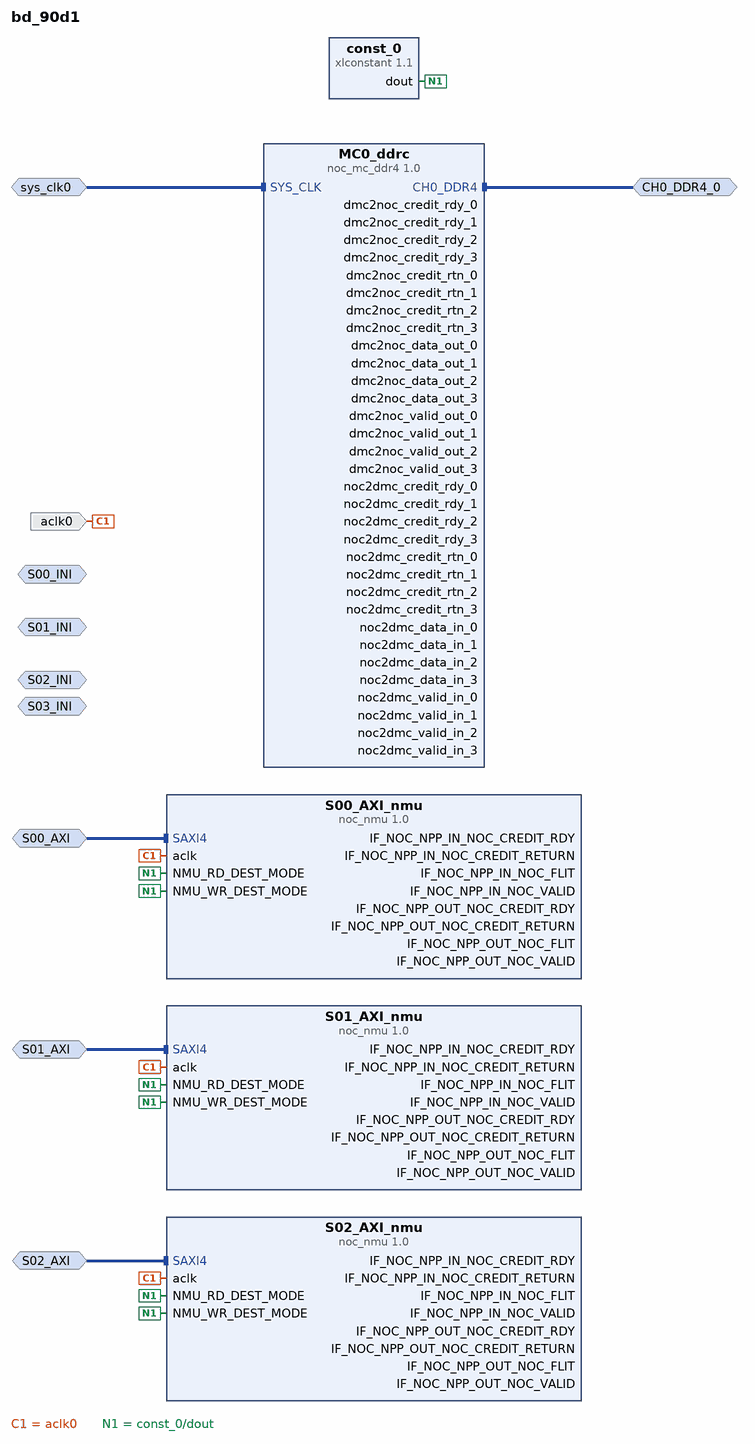
[diagram p0: block diagram of the top level]
# Vivado block design bd_90d1, xcvc1902-vsva2197-2MP-e-S, Vivado 2024.1
create_bd_design bd_90d1

create_bd_intf_port -mode Slave -vlnv xilinx.com:interface:aximm_rtl:1.0 S00_AXI
set_property -dict [list \
  CONFIG.CATEGORY pl \
  CONFIG.CONNECTIONS {MC_1 {read_bw {1192} write_bw {1192} read_avg_burst {8} write_avg_burst {8}}} \
] [get_bd_intf_ports S00_AXI]
create_bd_intf_port -mode Slave -vlnv xilinx.com:interface:aximm_rtl:1.0 S01_AXI
set_property -dict [list \
  CONFIG.CATEGORY pl \
  CONFIG.CONNECTIONS {MC_2 {read_bw {1192} write_bw {1192} read_avg_burst {8} write_avg_burst {8}}} \
] [get_bd_intf_ports S01_AXI]
create_bd_intf_port -mode Slave -vlnv xilinx.com:interface:aximm_rtl:1.0 S02_AXI
set_property -dict [list \
  CONFIG.CATEGORY pl \
  CONFIG.CONNECTIONS {MC_3 {read_bw {1192} write_bw {1192} read_avg_burst {8} write_avg_burst {8}}} \
] [get_bd_intf_ports S02_AXI]
create_bd_intf_port -mode Slave -vlnv xilinx.com:interface:inimm_rtl:1.0 S00_INI
set_property -dict [list \
  CONFIG.CONNECTIONS {MC_0 { read_bw {5} write_bw {5} read_avg_burst {4} write_avg_burst {4}} } \
  CONFIG.INI_STRATEGY auto \
] [get_bd_intf_ports S00_INI]
create_bd_intf_port -mode Slave -vlnv xilinx.com:interface:inimm_rtl:1.0 S01_INI
set_property -dict [list \
  CONFIG.CONNECTIONS {MC_1 { read_bw {5} write_bw {5} read_avg_burst {4} write_avg_burst {4}} } \
  CONFIG.INI_STRATEGY auto \
] [get_bd_intf_ports S01_INI]
create_bd_intf_port -mode Slave -vlnv xilinx.com:interface:inimm_rtl:1.0 S02_INI
set_property -dict [list \
  CONFIG.CONNECTIONS {MC_2 { read_bw {5} write_bw {5} read_avg_burst {4} write_avg_burst {4}} } \
  CONFIG.INI_STRATEGY auto \
] [get_bd_intf_ports S02_INI]
create_bd_intf_port -mode Slave -vlnv xilinx.com:interface:inimm_rtl:1.0 S03_INI
set_property -dict [list \
  CONFIG.CONNECTIONS {MC_3 { read_bw {5} write_bw {5} read_avg_burst {4} write_avg_burst {4}} } \
  CONFIG.INI_STRATEGY auto \
] [get_bd_intf_ports S03_INI]
create_bd_intf_port -mode Slave -vlnv xilinx.com:interface:diff_clock_rtl:1.0 sys_clk0
create_bd_intf_port -mode Master -vlnv xilinx.com:interface:ddr4_rtl:1.0 CH0_DDR4_0
create_bd_port -dir I -type clk aclk0
set_property -dict {CONFIG.ASSOCIATED_BUSIF S00_AXI:S01_AXI:S02_AXI} [get_bd_ports aclk0]

create_bd_cell -type ip -vlnv xilinx.com:ip:noc_nmu:1.0 S02_AXI_nmu
set_property -dict [list \
  CONFIG.ATTR_FILE nocattrs.dat \
  CONFIG.NOC_FREQ 1000 \
  CONFIG.USER_NOC_CATEGORY PL \
  CONFIG.USER_NOC_DATA512_WIDTH 32 \
  CONFIG.USER_NOC_NMU_WIDTH 512 \
  CONFIG.USER_PHYS_NAME NOC_NMU512_X0Y1 \
  CONFIG.USER_REG_ADDR_DST0 0x00000 \
  CONFIG.USER_REG_ADDR_DST1 0x00000 \
  CONFIG.USER_REG_ADDR_DST2 0x00000 \
  CONFIG.USER_REG_ADDR_DST3 0x00000 \
  CONFIG.USER_REG_ADDR_DST4 0x00000 \
  CONFIG.USER_REG_ADDR_DST5 0x00000 \
  CONFIG.USER_REG_ADDR_DST6 0x00000 \
  CONFIG.USER_REG_ADDR_DST7 0x00000 \
  CONFIG.USER_REG_ADDR_DST8 0x00000 \
  CONFIG.USER_REG_ADDR_DST9 0x00000 \
  CONFIG.USER_REG_ADDR_DST10 0x00000 \
  CONFIG.USER_REG_ADDR_DST11 0x00000 \
  CONFIG.USER_REG_ADDR_DST12 0x00000 \
  CONFIG.USER_REG_ADDR_DST13 0x00000 \
  CONFIG.USER_REG_ADDR_DST14 0x00000 \
  CONFIG.USER_REG_ADDR_DST15 0x00000 \
  CONFIG.USER_REG_ADDR_ENABLE 0x0000 \
  CONFIG.USER_REG_ADDR_MADDR0 0x00000000 \
  CONFIG.USER_REG_ADDR_MADDR1 0x00000000 \
  CONFIG.USER_REG_ADDR_MADDR2 0x00000000 \
  CONFIG.USER_REG_ADDR_MADDR3 0x00000000 \
  CONFIG.USER_REG_ADDR_MADDR4 0x00000000 \
  CONFIG.USER_REG_ADDR_MADDR5 0x00000000 \
  CONFIG.USER_REG_ADDR_MADDR6 0x00000000 \
  CONFIG.USER_REG_ADDR_MADDR7 0x00000000 \
  CONFIG.USER_REG_ADDR_MADDR8 0x00000000 \
  CONFIG.USER_REG_ADDR_MADDR9 0x00000000 \
  CONFIG.USER_REG_ADDR_MADDR10 0x00000000 \
  CONFIG.USER_REG_ADDR_MADDR11 0x00000000 \
  CONFIG.USER_REG_ADDR_MADDR12 0x00000000 \
  CONFIG.USER_REG_ADDR_MADDR13 0x00000000 \
  CONFIG.USER_REG_ADDR_MADDR14 0x00000000 \
  CONFIG.USER_REG_ADDR_MADDR15 0x00000000 \
  CONFIG.USER_REG_ADDR_MASK0 0x00000000 \
  CONFIG.USER_REG_ADDR_MASK1 0x00000000 \
  CONFIG.USER_REG_ADDR_MASK2 0x00000000 \
  CONFIG.USER_REG_ADDR_MASK3 0x00000000 \
  CONFIG.USER_REG_ADDR_MASK4 0x00000000 \
  CONFIG.USER_REG_ADDR_MASK5 0x00000000 \
  CONFIG.USER_REG_ADDR_MASK6 0x00000000 \
  CONFIG.USER_REG_ADDR_MASK7 0x00000000 \
  CONFIG.USER_REG_ADDR_MASK8 0x00000000 \
  CONFIG.USER_REG_ADDR_MASK9 0x00000000 \
  CONFIG.USER_REG_ADDR_MASK10 0x00000000 \
  CONFIG.USER_REG_ADDR_MASK11 0x00000000 \
  CONFIG.USER_REG_ADDR_MASK12 0x00000000 \
  CONFIG.USER_REG_ADDR_MASK13 0x00000000 \
  CONFIG.USER_REG_ADDR_MASK14 0x00000000 \
  CONFIG.USER_REG_ADDR_MASK15 0x00000000 \
  CONFIG.USER_REG_ADDR_REMAP 0x0000 \
  CONFIG.USER_REG_ADDR_RPADDR0 0x00000000 \
  CONFIG.USER_REG_ADDR_RPADDR1 0x00000000 \
  CONFIG.USER_REG_ADDR_RPADDR2 0x00000000 \
  CONFIG.USER_REG_ADDR_RPADDR3 0x00000000 \
  CONFIG.USER_REG_ADDR_RPADDR4 0x00000000 \
  CONFIG.USER_REG_ADDR_RPADDR5 0x00000000 \
  CONFIG.USER_REG_ADDR_RPADDR6 0x00000000 \
  CONFIG.USER_REG_ADDR_RPADDR7 0x00000000 \
  CONFIG.USER_REG_ADDR_RPADDR8 0x00000000 \
  CONFIG.USER_REG_ADDR_RPADDR9 0x00000000 \
  CONFIG.USER_REG_ADDR_RPADDR10 0x00000000 \
  CONFIG.USER_REG_ADDR_RPADDR11 0x00000000 \
  CONFIG.USER_REG_ADDR_RPADDR12 0x00000000 \
  CONFIG.USER_REG_ADDR_RPADDR13 0x00000000 \
  CONFIG.USER_REG_ADDR_RPADDR14 0x00000000 \
  CONFIG.USER_REG_ADDR_RPADDR15 0x00000000 \
  CONFIG.USER_REG_ADR_MAP_CPM 0x0FC0 \
  CONFIG.USER_REG_ADR_MAP_FPD_AFI_0 0x0FC0 \
  CONFIG.USER_REG_ADR_MAP_FPD_AFI_1 0x0FC0 \
  CONFIG.USER_REG_ADR_MAP_LPD_AFI_FS 0x0FC0 \
  CONFIG.USER_REG_ADR_MAP_ME_ARRAY_0 0x0FC0 \
  CONFIG.USER_REG_ADR_MAP_ME_ARRAY_1 0x0FC0 \
  CONFIG.USER_REG_ADR_MAP_ME_ARRAY_2 0x0FC0 \
  CONFIG.USER_REG_ADR_MAP_ME_ARRAY_3 0x0FC0 \
  CONFIG.USER_REG_ADR_MAP_PCIE 0x0FC0 \
  CONFIG.USER_REG_ADR_MAP_PMC 0x0FC0 \
  CONFIG.USER_REG_ADR_MAP_PMC_ALIAS_0 0x0FC0 \
  CONFIG.USER_REG_ADR_MAP_PMC_ALIAS_1 0x0FC0 \
  CONFIG.USER_REG_ADR_MAP_PMC_ALIAS_2 0x0FC0 \
  CONFIG.USER_REG_ADR_MAP_PMC_ALIAS_3 0x0FC0 \
  CONFIG.USER_REG_ADR_MAP_QSPI 0x0FC0 \
  CONFIG.USER_REG_ADR_MAP_STM_GIC 0x0FC0 \
  CONFIG.USER_REG_ADR_MAP_XPDS 0x0FC0 \
  CONFIG.USER_REG_AXI_LOOPBACK 0x00 \
  CONFIG.USER_REG_AXI_NON_MOD_DISABLE 0x0 \
  CONFIG.USER_REG_AXI_PAR_CHK 0x0 \
  CONFIG.USER_REG_CHOPSIZE 0xA \
  CONFIG.USER_REG_DDR_ADR_MAP0 0x06000 \
  CONFIG.USER_REG_DDR_ADR_MAP1 0x01FFF \
  CONFIG.USER_REG_DDR_ADR_MAP2 0x01FFF \
  CONFIG.USER_REG_DDR_ADR_MAP3 0x01FFF \
  CONFIG.USER_REG_DDR_ADR_MAP4 0x01FFF \
  CONFIG.USER_REG_DDR_ADR_MAP5 0x01FFF \
  CONFIG.USER_REG_DDR_ADR_MAP6 0x01FFF \
  CONFIG.USER_REG_DDR_DST_MAP0 0x4C0 \
  CONFIG.USER_REG_DDR_DST_MAP1 0xFC0 \
  CONFIG.USER_REG_DDR_DST_MAP2 0xFC0 \
  CONFIG.USER_REG_DDR_DST_MAP3 0xFC0 \
  CONFIG.USER_REG_DDR_DST_MAP4 0xFC0 \
  CONFIG.USER_REG_DDR_DST_MAP5 0xFC0 \
  CONFIG.USER_REG_DDR_DST_MAP6 0xFC0 \
  CONFIG.USER_REG_DDR_DST_MAP7 0xFC0 \
  CONFIG.USER_REG_DWIDTH 0x2 \
  CONFIG.USER_REG_ECC_CHK_EN 0x1 \
  CONFIG.USER_REG_HBM_MAP_T0_CH0 0x0FC0 \
  CONFIG.USER_REG_HBM_MAP_T0_CH1 0x0FC0 \
  CONFIG.USER_REG_HBM_MAP_T0_CH2 0x0FC0 \
  CONFIG.USER_REG_HBM_MAP_T0_CH3 0x0FC0 \
  CONFIG.USER_REG_HBM_MAP_T0_CH4 0x0FC0 \
  CONFIG.USER_REG_HBM_MAP_T0_CH5 0x0FC0 \
  CONFIG.USER_REG_HBM_MAP_T0_CH6 0x0FC0 \
  CONFIG.USER_REG_HBM_MAP_T0_CH7 0x0FC0 \
  CONFIG.USER_REG_HBM_MAP_T0_CH8 0x0FC0 \
  CONFIG.USER_REG_HBM_MAP_T0_CH9 0x0FC0 \
  CONFIG.USER_REG_HBM_MAP_T0_CH10 0x0FC0 \
  CONFIG.USER_REG_HBM_MAP_T0_CH11 0x0FC0 \
  CONFIG.USER_REG_HBM_MAP_T0_CH12 0x0FC0 \
  CONFIG.USER_REG_HBM_MAP_T0_CH13 0x0FC0 \
  CONFIG.USER_REG_HBM_MAP_T0_CH14 0x0FC0 \
  CONFIG.USER_REG_HBM_MAP_T0_CH15 0x0FC0 \
  CONFIG.USER_REG_HBM_MAP_T1_CH0 0x0FC0 \
  CONFIG.USER_REG_HBM_MAP_T1_CH1 0x0FC0 \
  CONFIG.USER_REG_HBM_MAP_T1_CH2 0x0FC0 \
  CONFIG.USER_REG_HBM_MAP_T1_CH3 0x0FC0 \
  CONFIG.USER_REG_HBM_MAP_T1_CH4 0x0FC0 \
  CONFIG.USER_REG_HBM_MAP_T1_CH5 0x0FC0 \
  CONFIG.USER_REG_HBM_MAP_T1_CH6 0x0FC0 \
  CONFIG.USER_REG_HBM_MAP_T1_CH7 0x0FC0 \
  CONFIG.USER_REG_HBM_MAP_T1_CH8 0x0FC0 \
  CONFIG.USER_REG_HBM_MAP_T1_CH9 0x0FC0 \
  CONFIG.USER_REG_HBM_MAP_T1_CH10 0x0FC0 \
  CONFIG.USER_REG_HBM_MAP_T1_CH11 0x0FC0 \
  CONFIG.USER_REG_HBM_MAP_T1_CH12 0x0FC0 \
  CONFIG.USER_REG_HBM_MAP_T1_CH13 0x0FC0 \
  CONFIG.USER_REG_HBM_MAP_T1_CH14 0x0FC0 \
  CONFIG.USER_REG_HBM_MAP_T1_CH15 0x0FC0 \
  CONFIG.USER_REG_HBM_MAP_T2_CH0 0x0FC0 \
  CONFIG.USER_REG_HBM_MAP_T2_CH1 0x0FC0 \
  CONFIG.USER_REG_HBM_MAP_T2_CH2 0x0FC0 \
  CONFIG.USER_REG_HBM_MAP_T2_CH3 0x0FC0 \
  CONFIG.USER_REG_HBM_MAP_T2_CH4 0x0FC0 \
  CONFIG.USER_REG_HBM_MAP_T2_CH5 0x0FC0 \
  CONFIG.USER_REG_HBM_MAP_T2_CH6 0x0FC0 \
  CONFIG.USER_REG_HBM_MAP_T2_CH7 0x0FC0 \
  CONFIG.USER_REG_HBM_MAP_T2_CH8 0x0FC0 \
  CONFIG.USER_REG_HBM_MAP_T2_CH9 0x0FC0 \
  CONFIG.USER_REG_HBM_MAP_T2_CH10 0x0FC0 \
  CONFIG.USER_REG_HBM_MAP_T2_CH11 0x0FC0 \
  CONFIG.USER_REG_HBM_MAP_T2_CH12 0x0FC0 \
  CONFIG.USER_REG_HBM_MAP_T2_CH13 0x0FC0 \
  CONFIG.USER_REG_HBM_MAP_T2_CH14 0x0FC0 \
  CONFIG.USER_REG_HBM_MAP_T2_CH15 0x0FC0 \
  CONFIG.USER_REG_HBM_MAP_T3_CH0 0x0FC0 \
  CONFIG.USER_REG_HBM_MAP_T3_CH1 0x0FC0 \
  CONFIG.USER_REG_HBM_MAP_T3_CH2 0x0FC0 \
  CONFIG.USER_REG_HBM_MAP_T3_CH3 0x0FC0 \
  CONFIG.USER_REG_HBM_MAP_T3_CH4 0x0FC0 \
  CONFIG.USER_REG_HBM_MAP_T3_CH5 0x0FC0 \
  CONFIG.USER_REG_HBM_MAP_T3_CH6 0x0FC0 \
  CONFIG.USER_REG_HBM_MAP_T3_CH7 0x0FC0 \
  CONFIG.USER_REG_HBM_MAP_T3_CH8 0x0FC0 \
  CONFIG.USER_REG_HBM_MAP_T3_CH9 0x0FC0 \
  CONFIG.USER_REG_HBM_MAP_T3_CH10 0x0FC0 \
  CONFIG.USER_REG_HBM_MAP_T3_CH11 0x0FC0 \
  CONFIG.USER_REG_HBM_MAP_T3_CH12 0x0FC0 \
  CONFIG.USER_REG_HBM_MAP_T3_CH13 0x0FC0 \
  CONFIG.USER_REG_HBM_MAP_T3_CH14 0x0FC0 \
  CONFIG.USER_REG_HBM_MAP_T3_CH15 0x0FC0 \
  CONFIG.USER_REG_MODE_SELECT 0x0000 \
  CONFIG.USER_REG_OUTSTANDING_RD_TXN 0x40 \
  CONFIG.USER_REG_OUTSTANDING_WR_TXN 0x40 \
  CONFIG.USER_REG_PRIORITY 0x0 \
  CONFIG.USER_REG_RD_AXPROT_SEL 0x00 \
  CONFIG.USER_REG_RD_RATE_CREDIT_DROP 0x004 \
  CONFIG.USER_REG_RD_RATE_CREDIT_LIMIT 0x0100 \
  CONFIG.USER_REG_RD_VCA_TOKEN0 0x55 \
  CONFIG.USER_REG_RPOISON_TO_SLVERR 0x0 \
  CONFIG.USER_REG_RROB_RAM_SETTING 0x012 \
  CONFIG.USER_REG_SMID_SEL 0x00000 \
  CONFIG.USER_REG_SRC 0x000 \
  CONFIG.USER_REG_TBASE_AXI_TIMEOUT 0x1 \
  CONFIG.USER_REG_TBASE_MODE_RLIMIT_RD 0x2 \
  CONFIG.USER_REG_TBASE_MODE_RLIMIT_WR 0x2 \
  CONFIG.USER_REG_TBASE_TRK_TIMEOUT 0x1 \
  CONFIG.USER_REG_VC_MAP 0xFAC \
  CONFIG.USER_REG_WBUF_LAUNCH_SIZE 0x10 \
  CONFIG.USER_REG_WBUF_RAM_SETTING 0x012 \
  CONFIG.USER_REG_WR_AXPROT_SEL 0x00 \
  CONFIG.USER_REG_WR_RATE_CREDIT_DROP 0x004 \
  CONFIG.USER_REG_WR_RATE_CREDIT_LIMIT 0x0100 \
  CONFIG.USER_REG_WR_VCA_TOKEN0 0xFF \
] [get_bd_cells S02_AXI_nmu]
create_bd_cell -type ip -vlnv xilinx.com:ip:xlconstant:1.1 const_0
set_property -dict {CONFIG.CONST_VAL 0 CONFIG.CONST_WIDTH 1} [get_bd_cells const_0]
create_bd_cell -type ip -vlnv xilinx.com:ip:noc_nmu:1.0 S01_AXI_nmu
set_property -dict [list \
  CONFIG.ATTR_FILE nocattrs.dat \
  CONFIG.NOC_FREQ 1000 \
  CONFIG.USER_NOC_CATEGORY PL \
  CONFIG.USER_NOC_DATA512_WIDTH 32 \
  CONFIG.USER_NOC_NMU_WIDTH 512 \
  CONFIG.USER_PHYS_NAME NOC_NMU512_X1Y0 \
  CONFIG.USER_REG_ADDR_DST0 0x00000 \
  CONFIG.USER_REG_ADDR_DST1 0x00000 \
  CONFIG.USER_REG_ADDR_DST2 0x00000 \
  CONFIG.USER_REG_ADDR_DST3 0x00000 \
  CONFIG.USER_REG_ADDR_DST4 0x00000 \
  CONFIG.USER_REG_ADDR_DST5 0x00000 \
  CONFIG.USER_REG_ADDR_DST6 0x00000 \
  CONFIG.USER_REG_ADDR_DST7 0x00000 \
  CONFIG.USER_REG_ADDR_DST8 0x00000 \
  CONFIG.USER_REG_ADDR_DST9 0x00000 \
  CONFIG.USER_REG_ADDR_DST10 0x00000 \
  CONFIG.USER_REG_ADDR_DST11 0x00000 \
  CONFIG.USER_REG_ADDR_DST12 0x00000 \
  CONFIG.USER_REG_ADDR_DST13 0x00000 \
  CONFIG.USER_REG_ADDR_DST14 0x00000 \
  CONFIG.USER_REG_ADDR_DST15 0x00000 \
  CONFIG.USER_REG_ADDR_ENABLE 0x0000 \
  CONFIG.USER_REG_ADDR_MADDR0 0x00000000 \
  CONFIG.USER_REG_ADDR_MADDR1 0x00000000 \
  CONFIG.USER_REG_ADDR_MADDR2 0x00000000 \
  CONFIG.USER_REG_ADDR_MADDR3 0x00000000 \
  CONFIG.USER_REG_ADDR_MADDR4 0x00000000 \
  CONFIG.USER_REG_ADDR_MADDR5 0x00000000 \
  CONFIG.USER_REG_ADDR_MADDR6 0x00000000 \
  CONFIG.USER_REG_ADDR_MADDR7 0x00000000 \
  CONFIG.USER_REG_ADDR_MADDR8 0x00000000 \
  CONFIG.USER_REG_ADDR_MADDR9 0x00000000 \
  CONFIG.USER_REG_ADDR_MADDR10 0x00000000 \
  CONFIG.USER_REG_ADDR_MADDR11 0x00000000 \
  CONFIG.USER_REG_ADDR_MADDR12 0x00000000 \
  CONFIG.USER_REG_ADDR_MADDR13 0x00000000 \
  CONFIG.USER_REG_ADDR_MADDR14 0x00000000 \
  CONFIG.USER_REG_ADDR_MADDR15 0x00000000 \
  CONFIG.USER_REG_ADDR_MASK0 0x00000000 \
  CONFIG.USER_REG_ADDR_MASK1 0x00000000 \
  CONFIG.USER_REG_ADDR_MASK2 0x00000000 \
  CONFIG.USER_REG_ADDR_MASK3 0x00000000 \
  CONFIG.USER_REG_ADDR_MASK4 0x00000000 \
  CONFIG.USER_REG_ADDR_MASK5 0x00000000 \
  CONFIG.USER_REG_ADDR_MASK6 0x00000000 \
  CONFIG.USER_REG_ADDR_MASK7 0x00000000 \
  CONFIG.USER_REG_ADDR_MASK8 0x00000000 \
  CONFIG.USER_REG_ADDR_MASK9 0x00000000 \
  CONFIG.USER_REG_ADDR_MASK10 0x00000000 \
  CONFIG.USER_REG_ADDR_MASK11 0x00000000 \
  CONFIG.USER_REG_ADDR_MASK12 0x00000000 \
  CONFIG.USER_REG_ADDR_MASK13 0x00000000 \
  CONFIG.USER_REG_ADDR_MASK14 0x00000000 \
  CONFIG.USER_REG_ADDR_MASK15 0x00000000 \
  CONFIG.USER_REG_ADDR_REMAP 0x0000 \
  CONFIG.USER_REG_ADDR_RPADDR0 0x00000000 \
  CONFIG.USER_REG_ADDR_RPADDR1 0x00000000 \
  CONFIG.USER_REG_ADDR_RPADDR2 0x00000000 \
  CONFIG.USER_REG_ADDR_RPADDR3 0x00000000 \
  CONFIG.USER_REG_ADDR_RPADDR4 0x00000000 \
  CONFIG.USER_REG_ADDR_RPADDR5 0x00000000 \
  CONFIG.USER_REG_ADDR_RPADDR6 0x00000000 \
  CONFIG.USER_REG_ADDR_RPADDR7 0x00000000 \
  CONFIG.USER_REG_ADDR_RPADDR8 0x00000000 \
  CONFIG.USER_REG_ADDR_RPADDR9 0x00000000 \
  CONFIG.USER_REG_ADDR_RPADDR10 0x00000000 \
  CONFIG.USER_REG_ADDR_RPADDR11 0x00000000 \
  CONFIG.USER_REG_ADDR_RPADDR12 0x00000000 \
  CONFIG.USER_REG_ADDR_RPADDR13 0x00000000 \
  CONFIG.USER_REG_ADDR_RPADDR14 0x00000000 \
  CONFIG.USER_REG_ADDR_RPADDR15 0x00000000 \
  CONFIG.USER_REG_ADR_MAP_CPM 0x0FC0 \
  CONFIG.USER_REG_ADR_MAP_FPD_AFI_0 0x0FC0 \
  CONFIG.USER_REG_ADR_MAP_FPD_AFI_1 0x0FC0 \
  CONFIG.USER_REG_ADR_MAP_LPD_AFI_FS 0x0FC0 \
  CONFIG.USER_REG_ADR_MAP_ME_ARRAY_0 0x0FC0 \
  CONFIG.USER_REG_ADR_MAP_ME_ARRAY_1 0x0FC0 \
  CONFIG.USER_REG_ADR_MAP_ME_ARRAY_2 0x0FC0 \
  CONFIG.USER_REG_ADR_MAP_ME_ARRAY_3 0x0FC0 \
  CONFIG.USER_REG_ADR_MAP_PCIE 0x0FC0 \
  CONFIG.USER_REG_ADR_MAP_PMC 0x0FC0 \
  CONFIG.USER_REG_ADR_MAP_PMC_ALIAS_0 0x0FC0 \
  CONFIG.USER_REG_ADR_MAP_PMC_ALIAS_1 0x0FC0 \
  CONFIG.USER_REG_ADR_MAP_PMC_ALIAS_2 0x0FC0 \
  CONFIG.USER_REG_ADR_MAP_PMC_ALIAS_3 0x0FC0 \
  CONFIG.USER_REG_ADR_MAP_QSPI 0x0FC0 \
  CONFIG.USER_REG_ADR_MAP_STM_GIC 0x0FC0 \
  CONFIG.USER_REG_ADR_MAP_XPDS 0x0FC0 \
  CONFIG.USER_REG_AXI_LOOPBACK 0x00 \
  CONFIG.USER_REG_AXI_NON_MOD_DISABLE 0x0 \
  CONFIG.USER_REG_AXI_PAR_CHK 0x0 \
  CONFIG.USER_REG_CHOPSIZE 0xA \
  CONFIG.USER_REG_DDR_ADR_MAP0 0x06000 \
  CONFIG.USER_REG_DDR_ADR_MAP1 0x01FFF \
  CONFIG.USER_REG_DDR_ADR_MAP2 0x01FFF \
  CONFIG.USER_REG_DDR_ADR_MAP3 0x01FFF \
  CONFIG.USER_REG_DDR_ADR_MAP4 0x01FFF \
  CONFIG.USER_REG_DDR_ADR_MAP5 0x01FFF \
  CONFIG.USER_REG_DDR_ADR_MAP6 0x01FFF \
  CONFIG.USER_REG_DDR_DST_MAP0 0x480 \
  CONFIG.USER_REG_DDR_DST_MAP1 0xFC0 \
  CONFIG.USER_REG_DDR_DST_MAP2 0xFC0 \
  CONFIG.USER_REG_DDR_DST_MAP3 0xFC0 \
  CONFIG.USER_REG_DDR_DST_MAP4 0xFC0 \
  CONFIG.USER_REG_DDR_DST_MAP5 0xFC0 \
  CONFIG.USER_REG_DDR_DST_MAP6 0xFC0 \
  CONFIG.USER_REG_DDR_DST_MAP7 0xFC0 \
  CONFIG.USER_REG_DWIDTH 0x2 \
  CONFIG.USER_REG_ECC_CHK_EN 0x1 \
  CONFIG.USER_REG_HBM_MAP_T0_CH0 0x0FC0 \
  CONFIG.USER_REG_HBM_MAP_T0_CH1 0x0FC0 \
  CONFIG.USER_REG_HBM_MAP_T0_CH2 0x0FC0 \
  CONFIG.USER_REG_HBM_MAP_T0_CH3 0x0FC0 \
  CONFIG.USER_REG_HBM_MAP_T0_CH4 0x0FC0 \
  CONFIG.USER_REG_HBM_MAP_T0_CH5 0x0FC0 \
  CONFIG.USER_REG_HBM_MAP_T0_CH6 0x0FC0 \
  CONFIG.USER_REG_HBM_MAP_T0_CH7 0x0FC0 \
  CONFIG.USER_REG_HBM_MAP_T0_CH8 0x0FC0 \
  CONFIG.USER_REG_HBM_MAP_T0_CH9 0x0FC0 \
  CONFIG.USER_REG_HBM_MAP_T0_CH10 0x0FC0 \
  CONFIG.USER_REG_HBM_MAP_T0_CH11 0x0FC0 \
  CONFIG.USER_REG_HBM_MAP_T0_CH12 0x0FC0 \
  CONFIG.USER_REG_HBM_MAP_T0_CH13 0x0FC0 \
  CONFIG.USER_REG_HBM_MAP_T0_CH14 0x0FC0 \
  CONFIG.USER_REG_HBM_MAP_T0_CH15 0x0FC0 \
  CONFIG.USER_REG_HBM_MAP_T1_CH0 0x0FC0 \
  CONFIG.USER_REG_HBM_MAP_T1_CH1 0x0FC0 \
  CONFIG.USER_REG_HBM_MAP_T1_CH2 0x0FC0 \
  CONFIG.USER_REG_HBM_MAP_T1_CH3 0x0FC0 \
  CONFIG.USER_REG_HBM_MAP_T1_CH4 0x0FC0 \
  CONFIG.USER_REG_HBM_MAP_T1_CH5 0x0FC0 \
  CONFIG.USER_REG_HBM_MAP_T1_CH6 0x0FC0 \
  CONFIG.USER_REG_HBM_MAP_T1_CH7 0x0FC0 \
  CONFIG.USER_REG_HBM_MAP_T1_CH8 0x0FC0 \
  CONFIG.USER_REG_HBM_MAP_T1_CH9 0x0FC0 \
  CONFIG.USER_REG_HBM_MAP_T1_CH10 0x0FC0 \
  CONFIG.USER_REG_HBM_MAP_T1_CH11 0x0FC0 \
  CONFIG.USER_REG_HBM_MAP_T1_CH12 0x0FC0 \
  CONFIG.USER_REG_HBM_MAP_T1_CH13 0x0FC0 \
  CONFIG.USER_REG_HBM_MAP_T1_CH14 0x0FC0 \
  CONFIG.USER_REG_HBM_MAP_T1_CH15 0x0FC0 \
  CONFIG.USER_REG_HBM_MAP_T2_CH0 0x0FC0 \
  CONFIG.USER_REG_HBM_MAP_T2_CH1 0x0FC0 \
  CONFIG.USER_REG_HBM_MAP_T2_CH2 0x0FC0 \
  CONFIG.USER_REG_HBM_MAP_T2_CH3 0x0FC0 \
  CONFIG.USER_REG_HBM_MAP_T2_CH4 0x0FC0 \
  CONFIG.USER_REG_HBM_MAP_T2_CH5 0x0FC0 \
  CONFIG.USER_REG_HBM_MAP_T2_CH6 0x0FC0 \
  CONFIG.USER_REG_HBM_MAP_T2_CH7 0x0FC0 \
  CONFIG.USER_REG_HBM_MAP_T2_CH8 0x0FC0 \
  CONFIG.USER_REG_HBM_MAP_T2_CH9 0x0FC0 \
  CONFIG.USER_REG_HBM_MAP_T2_CH10 0x0FC0 \
  CONFIG.USER_REG_HBM_MAP_T2_CH11 0x0FC0 \
  CONFIG.USER_REG_HBM_MAP_T2_CH12 0x0FC0 \
  CONFIG.USER_REG_HBM_MAP_T2_CH13 0x0FC0 \
  CONFIG.USER_REG_HBM_MAP_T2_CH14 0x0FC0 \
  CONFIG.USER_REG_HBM_MAP_T2_CH15 0x0FC0 \
  CONFIG.USER_REG_HBM_MAP_T3_CH0 0x0FC0 \
  CONFIG.USER_REG_HBM_MAP_T3_CH1 0x0FC0 \
  CONFIG.USER_REG_HBM_MAP_T3_CH2 0x0FC0 \
  CONFIG.USER_REG_HBM_MAP_T3_CH3 0x0FC0 \
  CONFIG.USER_REG_HBM_MAP_T3_CH4 0x0FC0 \
  CONFIG.USER_REG_HBM_MAP_T3_CH5 0x0FC0 \
  CONFIG.USER_REG_HBM_MAP_T3_CH6 0x0FC0 \
  CONFIG.USER_REG_HBM_MAP_T3_CH7 0x0FC0 \
  CONFIG.USER_REG_HBM_MAP_T3_CH8 0x0FC0 \
  CONFIG.USER_REG_HBM_MAP_T3_CH9 0x0FC0 \
  CONFIG.USER_REG_HBM_MAP_T3_CH10 0x0FC0 \
  CONFIG.USER_REG_HBM_MAP_T3_CH11 0x0FC0 \
  CONFIG.USER_REG_HBM_MAP_T3_CH12 0x0FC0 \
  CONFIG.USER_REG_HBM_MAP_T3_CH13 0x0FC0 \
  CONFIG.USER_REG_HBM_MAP_T3_CH14 0x0FC0 \
  CONFIG.USER_REG_HBM_MAP_T3_CH15 0x0FC0 \
  CONFIG.USER_REG_MODE_SELECT 0x0000 \
  CONFIG.USER_REG_OUTSTANDING_RD_TXN 0x40 \
  CONFIG.USER_REG_OUTSTANDING_WR_TXN 0x40 \
  CONFIG.USER_REG_PRIORITY 0x0 \
  CONFIG.USER_REG_RD_AXPROT_SEL 0x00 \
  CONFIG.USER_REG_RD_RATE_CREDIT_DROP 0x004 \
  CONFIG.USER_REG_RD_RATE_CREDIT_LIMIT 0x0100 \
  CONFIG.USER_REG_RD_VCA_TOKEN0 0x55 \
  CONFIG.USER_REG_RPOISON_TO_SLVERR 0x0 \
  CONFIG.USER_REG_RROB_RAM_SETTING 0x012 \
  CONFIG.USER_REG_SMID_SEL 0x00000 \
  CONFIG.USER_REG_SRC 0x080 \
  CONFIG.USER_REG_TBASE_AXI_TIMEOUT 0x1 \
  CONFIG.USER_REG_TBASE_MODE_RLIMIT_RD 0x2 \
  CONFIG.USER_REG_TBASE_MODE_RLIMIT_WR 0x2 \
  CONFIG.USER_REG_TBASE_TRK_TIMEOUT 0x1 \
  CONFIG.USER_REG_VC_MAP 0xFAC \
  CONFIG.USER_REG_WBUF_LAUNCH_SIZE 0x10 \
  CONFIG.USER_REG_WBUF_RAM_SETTING 0x012 \
  CONFIG.USER_REG_WR_AXPROT_SEL 0x00 \
  CONFIG.USER_REG_WR_RATE_CREDIT_DROP 0x004 \
  CONFIG.USER_REG_WR_RATE_CREDIT_LIMIT 0x0100 \
  CONFIG.USER_REG_WR_VCA_TOKEN0 0xFF \
] [get_bd_cells S01_AXI_nmu]
create_bd_cell -type ip -vlnv xilinx.com:ip:noc_nmu:1.0 S00_AXI_nmu
set_property -dict [list \
  CONFIG.ATTR_FILE nocattrs.dat \
  CONFIG.NOC_FREQ 1000 \
  CONFIG.USER_NOC_CATEGORY PL \
  CONFIG.USER_NOC_DATA512_WIDTH 32 \
  CONFIG.USER_NOC_NMU_WIDTH 512 \
  CONFIG.USER_PHYS_NAME NOC_NMU512_X0Y0 \
  CONFIG.USER_REG_ADDR_DST0 0x00000 \
  CONFIG.USER_REG_ADDR_DST1 0x00000 \
  CONFIG.USER_REG_ADDR_DST2 0x00000 \
  CONFIG.USER_REG_ADDR_DST3 0x00000 \
  CONFIG.USER_REG_ADDR_DST4 0x00000 \
  CONFIG.USER_REG_ADDR_DST5 0x00000 \
  CONFIG.USER_REG_ADDR_DST6 0x00000 \
  CONFIG.USER_REG_ADDR_DST7 0x00000 \
  CONFIG.USER_REG_ADDR_DST8 0x00000 \
  CONFIG.USER_REG_ADDR_DST9 0x00000 \
  CONFIG.USER_REG_ADDR_DST10 0x00000 \
  CONFIG.USER_REG_ADDR_DST11 0x00000 \
  CONFIG.USER_REG_ADDR_DST12 0x00000 \
  CONFIG.USER_REG_ADDR_DST13 0x00000 \
  CONFIG.USER_REG_ADDR_DST14 0x00000 \
  CONFIG.USER_REG_ADDR_DST15 0x00000 \
  CONFIG.USER_REG_ADDR_ENABLE 0x0000 \
  CONFIG.USER_REG_ADDR_MADDR0 0x00000000 \
  CONFIG.USER_REG_ADDR_MADDR1 0x00000000 \
  CONFIG.USER_REG_ADDR_MADDR2 0x00000000 \
  CONFIG.USER_REG_ADDR_MADDR3 0x00000000 \
  CONFIG.USER_REG_ADDR_MADDR4 0x00000000 \
  CONFIG.USER_REG_ADDR_MADDR5 0x00000000 \
  CONFIG.USER_REG_ADDR_MADDR6 0x00000000 \
  CONFIG.USER_REG_ADDR_MADDR7 0x00000000 \
  CONFIG.USER_REG_ADDR_MADDR8 0x00000000 \
  CONFIG.USER_REG_ADDR_MADDR9 0x00000000 \
  CONFIG.USER_REG_ADDR_MADDR10 0x00000000 \
  CONFIG.USER_REG_ADDR_MADDR11 0x00000000 \
  CONFIG.USER_REG_ADDR_MADDR12 0x00000000 \
  CONFIG.USER_REG_ADDR_MADDR13 0x00000000 \
  CONFIG.USER_REG_ADDR_MADDR14 0x00000000 \
  CONFIG.USER_REG_ADDR_MADDR15 0x00000000 \
  CONFIG.USER_REG_ADDR_MASK0 0x00000000 \
  CONFIG.USER_REG_ADDR_MASK1 0x00000000 \
  CONFIG.USER_REG_ADDR_MASK2 0x00000000 \
  CONFIG.USER_REG_ADDR_MASK3 0x00000000 \
  CONFIG.USER_REG_ADDR_MASK4 0x00000000 \
  CONFIG.USER_REG_ADDR_MASK5 0x00000000 \
  CONFIG.USER_REG_ADDR_MASK6 0x00000000 \
  CONFIG.USER_REG_ADDR_MASK7 0x00000000 \
  CONFIG.USER_REG_ADDR_MASK8 0x00000000 \
  CONFIG.USER_REG_ADDR_MASK9 0x00000000 \
  CONFIG.USER_REG_ADDR_MASK10 0x00000000 \
  CONFIG.USER_REG_ADDR_MASK11 0x00000000 \
  CONFIG.USER_REG_ADDR_MASK12 0x00000000 \
  CONFIG.USER_REG_ADDR_MASK13 0x00000000 \
  CONFIG.USER_REG_ADDR_MASK14 0x00000000 \
  CONFIG.USER_REG_ADDR_MASK15 0x00000000 \
  CONFIG.USER_REG_ADDR_REMAP 0x0000 \
  CONFIG.USER_REG_ADDR_RPADDR0 0x00000000 \
  CONFIG.USER_REG_ADDR_RPADDR1 0x00000000 \
  CONFIG.USER_REG_ADDR_RPADDR2 0x00000000 \
  CONFIG.USER_REG_ADDR_RPADDR3 0x00000000 \
  CONFIG.USER_REG_ADDR_RPADDR4 0x00000000 \
  CONFIG.USER_REG_ADDR_RPADDR5 0x00000000 \
  CONFIG.USER_REG_ADDR_RPADDR6 0x00000000 \
  CONFIG.USER_REG_ADDR_RPADDR7 0x00000000 \
  CONFIG.USER_REG_ADDR_RPADDR8 0x00000000 \
  CONFIG.USER_REG_ADDR_RPADDR9 0x00000000 \
  CONFIG.USER_REG_ADDR_RPADDR10 0x00000000 \
  CONFIG.USER_REG_ADDR_RPADDR11 0x00000000 \
  CONFIG.USER_REG_ADDR_RPADDR12 0x00000000 \
  CONFIG.USER_REG_ADDR_RPADDR13 0x00000000 \
  CONFIG.USER_REG_ADDR_RPADDR14 0x00000000 \
  CONFIG.USER_REG_ADDR_RPADDR15 0x00000000 \
  CONFIG.USER_REG_ADR_MAP_CPM 0x0FC0 \
  CONFIG.USER_REG_ADR_MAP_FPD_AFI_0 0x0FC0 \
  CONFIG.USER_REG_ADR_MAP_FPD_AFI_1 0x0FC0 \
  CONFIG.USER_REG_ADR_MAP_LPD_AFI_FS 0x0FC0 \
  CONFIG.USER_REG_ADR_MAP_ME_ARRAY_0 0x0FC0 \
  CONFIG.USER_REG_ADR_MAP_ME_ARRAY_1 0x0FC0 \
  CONFIG.USER_REG_ADR_MAP_ME_ARRAY_2 0x0FC0 \
  CONFIG.USER_REG_ADR_MAP_ME_ARRAY_3 0x0FC0 \
  CONFIG.USER_REG_ADR_MAP_PCIE 0x0FC0 \
  CONFIG.USER_REG_ADR_MAP_PMC 0x0FC0 \
  CONFIG.USER_REG_ADR_MAP_PMC_ALIAS_0 0x0FC0 \
  CONFIG.USER_REG_ADR_MAP_PMC_ALIAS_1 0x0FC0 \
  CONFIG.USER_REG_ADR_MAP_PMC_ALIAS_2 0x0FC0 \
  CONFIG.USER_REG_ADR_MAP_PMC_ALIAS_3 0x0FC0 \
  CONFIG.USER_REG_ADR_MAP_QSPI 0x0FC0 \
  CONFIG.USER_REG_ADR_MAP_STM_GIC 0x0FC0 \
  CONFIG.USER_REG_ADR_MAP_XPDS 0x0FC0 \
  CONFIG.USER_REG_AXI_LOOPBACK 0x00 \
  CONFIG.USER_REG_AXI_NON_MOD_DISABLE 0x0 \
  CONFIG.USER_REG_AXI_PAR_CHK 0x0 \
  CONFIG.USER_REG_CHOPSIZE 0xA \
  CONFIG.USER_REG_DDR_ADR_MAP0 0x06000 \
  CONFIG.USER_REG_DDR_ADR_MAP1 0x01FFF \
  CONFIG.USER_REG_DDR_ADR_MAP2 0x01FFF \
  CONFIG.USER_REG_DDR_ADR_MAP3 0x01FFF \
  CONFIG.USER_REG_DDR_ADR_MAP4 0x01FFF \
  CONFIG.USER_REG_DDR_ADR_MAP5 0x01FFF \
  CONFIG.USER_REG_DDR_ADR_MAP6 0x01FFF \
  CONFIG.USER_REG_DDR_DST_MAP0 0x440 \
  CONFIG.USER_REG_DDR_DST_MAP1 0xFC0 \
  CONFIG.USER_REG_DDR_DST_MAP2 0xFC0 \
  CONFIG.USER_REG_DDR_DST_MAP3 0xFC0 \
  CONFIG.USER_REG_DDR_DST_MAP4 0xFC0 \
  CONFIG.USER_REG_DDR_DST_MAP5 0xFC0 \
  CONFIG.USER_REG_DDR_DST_MAP6 0xFC0 \
  CONFIG.USER_REG_DDR_DST_MAP7 0xFC0 \
  CONFIG.USER_REG_DWIDTH 0x2 \
  CONFIG.USER_REG_ECC_CHK_EN 0x1 \
  CONFIG.USER_REG_HBM_MAP_T0_CH0 0x0FC0 \
  CONFIG.USER_REG_HBM_MAP_T0_CH1 0x0FC0 \
  CONFIG.USER_REG_HBM_MAP_T0_CH2 0x0FC0 \
  CONFIG.USER_REG_HBM_MAP_T0_CH3 0x0FC0 \
  CONFIG.USER_REG_HBM_MAP_T0_CH4 0x0FC0 \
  CONFIG.USER_REG_HBM_MAP_T0_CH5 0x0FC0 \
  CONFIG.USER_REG_HBM_MAP_T0_CH6 0x0FC0 \
  CONFIG.USER_REG_HBM_MAP_T0_CH7 0x0FC0 \
  CONFIG.USER_REG_HBM_MAP_T0_CH8 0x0FC0 \
  CONFIG.USER_REG_HBM_MAP_T0_CH9 0x0FC0 \
  CONFIG.USER_REG_HBM_MAP_T0_CH10 0x0FC0 \
  CONFIG.USER_REG_HBM_MAP_T0_CH11 0x0FC0 \
  CONFIG.USER_REG_HBM_MAP_T0_CH12 0x0FC0 \
  CONFIG.USER_REG_HBM_MAP_T0_CH13 0x0FC0 \
  CONFIG.USER_REG_HBM_MAP_T0_CH14 0x0FC0 \
  CONFIG.USER_REG_HBM_MAP_T0_CH15 0x0FC0 \
  CONFIG.USER_REG_HBM_MAP_T1_CH0 0x0FC0 \
  CONFIG.USER_REG_HBM_MAP_T1_CH1 0x0FC0 \
  CONFIG.USER_REG_HBM_MAP_T1_CH2 0x0FC0 \
  CONFIG.USER_REG_HBM_MAP_T1_CH3 0x0FC0 \
  CONFIG.USER_REG_HBM_MAP_T1_CH4 0x0FC0 \
  CONFIG.USER_REG_HBM_MAP_T1_CH5 0x0FC0 \
  CONFIG.USER_REG_HBM_MAP_T1_CH6 0x0FC0 \
  CONFIG.USER_REG_HBM_MAP_T1_CH7 0x0FC0 \
  CONFIG.USER_REG_HBM_MAP_T1_CH8 0x0FC0 \
  CONFIG.USER_REG_HBM_MAP_T1_CH9 0x0FC0 \
  CONFIG.USER_REG_HBM_MAP_T1_CH10 0x0FC0 \
  CONFIG.USER_REG_HBM_MAP_T1_CH11 0x0FC0 \
  CONFIG.USER_REG_HBM_MAP_T1_CH12 0x0FC0 \
  CONFIG.USER_REG_HBM_MAP_T1_CH13 0x0FC0 \
  CONFIG.USER_REG_HBM_MAP_T1_CH14 0x0FC0 \
  CONFIG.USER_REG_HBM_MAP_T1_CH15 0x0FC0 \
  CONFIG.USER_REG_HBM_MAP_T2_CH0 0x0FC0 \
  CONFIG.USER_REG_HBM_MAP_T2_CH1 0x0FC0 \
  CONFIG.USER_REG_HBM_MAP_T2_CH2 0x0FC0 \
  CONFIG.USER_REG_HBM_MAP_T2_CH3 0x0FC0 \
  CONFIG.USER_REG_HBM_MAP_T2_CH4 0x0FC0 \
  CONFIG.USER_REG_HBM_MAP_T2_CH5 0x0FC0 \
  CONFIG.USER_REG_HBM_MAP_T2_CH6 0x0FC0 \
  CONFIG.USER_REG_HBM_MAP_T2_CH7 0x0FC0 \
  CONFIG.USER_REG_HBM_MAP_T2_CH8 0x0FC0 \
  CONFIG.USER_REG_HBM_MAP_T2_CH9 0x0FC0 \
  CONFIG.USER_REG_HBM_MAP_T2_CH10 0x0FC0 \
  CONFIG.USER_REG_HBM_MAP_T2_CH11 0x0FC0 \
  CONFIG.USER_REG_HBM_MAP_T2_CH12 0x0FC0 \
  CONFIG.USER_REG_HBM_MAP_T2_CH13 0x0FC0 \
  CONFIG.USER_REG_HBM_MAP_T2_CH14 0x0FC0 \
  CONFIG.USER_REG_HBM_MAP_T2_CH15 0x0FC0 \
  CONFIG.USER_REG_HBM_MAP_T3_CH0 0x0FC0 \
  CONFIG.USER_REG_HBM_MAP_T3_CH1 0x0FC0 \
  CONFIG.USER_REG_HBM_MAP_T3_CH2 0x0FC0 \
  CONFIG.USER_REG_HBM_MAP_T3_CH3 0x0FC0 \
  CONFIG.USER_REG_HBM_MAP_T3_CH4 0x0FC0 \
  CONFIG.USER_REG_HBM_MAP_T3_CH5 0x0FC0 \
  CONFIG.USER_REG_HBM_MAP_T3_CH6 0x0FC0 \
  CONFIG.USER_REG_HBM_MAP_T3_CH7 0x0FC0 \
  CONFIG.USER_REG_HBM_MAP_T3_CH8 0x0FC0 \
  CONFIG.USER_REG_HBM_MAP_T3_CH9 0x0FC0 \
  CONFIG.USER_REG_HBM_MAP_T3_CH10 0x0FC0 \
  CONFIG.USER_REG_HBM_MAP_T3_CH11 0x0FC0 \
  CONFIG.USER_REG_HBM_MAP_T3_CH12 0x0FC0 \
  CONFIG.USER_REG_HBM_MAP_T3_CH13 0x0FC0 \
  CONFIG.USER_REG_HBM_MAP_T3_CH14 0x0FC0 \
  CONFIG.USER_REG_HBM_MAP_T3_CH15 0x0FC0 \
  CONFIG.USER_REG_MODE_SELECT 0x0000 \
  CONFIG.USER_REG_OUTSTANDING_RD_TXN 0x40 \
  CONFIG.USER_REG_OUTSTANDING_WR_TXN 0x40 \
  CONFIG.USER_REG_PRIORITY 0x0 \
  CONFIG.USER_REG_RD_AXPROT_SEL 0x00 \
  CONFIG.USER_REG_RD_RATE_CREDIT_DROP 0x004 \
  CONFIG.USER_REG_RD_RATE_CREDIT_LIMIT 0x0100 \
  CONFIG.USER_REG_RD_VCA_TOKEN0 0x55 \
  CONFIG.USER_REG_RPOISON_TO_SLVERR 0x0 \
  CONFIG.USER_REG_RROB_RAM_SETTING 0x012 \
  CONFIG.USER_REG_SMID_SEL 0x00000 \
  CONFIG.USER_REG_SRC 0x040 \
  CONFIG.USER_REG_TBASE_AXI_TIMEOUT 0x1 \
  CONFIG.USER_REG_TBASE_MODE_RLIMIT_RD 0x2 \
  CONFIG.USER_REG_TBASE_MODE_RLIMIT_WR 0x2 \
  CONFIG.USER_REG_TBASE_TRK_TIMEOUT 0x1 \
  CONFIG.USER_REG_VC_MAP 0xFAC \
  CONFIG.USER_REG_WBUF_LAUNCH_SIZE 0x10 \
  CONFIG.USER_REG_WBUF_RAM_SETTING 0x012 \
  CONFIG.USER_REG_WR_AXPROT_SEL 0x00 \
  CONFIG.USER_REG_WR_RATE_CREDIT_DROP 0x004 \
  CONFIG.USER_REG_WR_RATE_CREDIT_LIMIT 0x0100 \
  CONFIG.USER_REG_WR_VCA_TOKEN0 0xFF \
] [get_bd_cells S00_AXI_nmu]
create_bd_cell -type ip -vlnv xilinx.com:ip:noc_mc_ddr4:1.0 MC0_ddrc
set_property -dict [list \
  CONFIG.CONTROLLERTYPE DDR4_SDRAM \
  CONFIG.MC_ADDRESSMAP ROW_COLUMN_BANK \
  CONFIG.MC_ADDR_BIT33 NA \
  CONFIG.MC_ADDR_BIT34 NA \
  CONFIG.MC_ADDR_BIT35 NA \
  CONFIG.MC_ADDR_BIT36 NA \
  CONFIG.MC_ADDR_BIT37 NA \
  CONFIG.MC_ADDR_BIT38 NA \
  CONFIG.MC_ADDR_BIT39 NA \
  CONFIG.MC_ADDR_BIT40 NA \
  CONFIG.MC_ADDR_BIT41 NA \
  CONFIG.MC_ADDR_BIT42 NA \
  CONFIG.MC_ADDR_BIT43 NA \
  CONFIG.MC_ADDR_WIDTH 17 \
  CONFIG.MC_ADD_CMD_DELAY 0 \
  CONFIG.MC_ADD_CMD_DELAY_EN Disable \
  CONFIG.MC_ATTR_FILE nocattrs.dat \
  CONFIG.MC_BURST_LENGTH 8 \
  CONFIG.MC_CAL_MASK_POLL ENABLE \
  CONFIG.MC_CASLATENCY 22 \
  CONFIG.MC_CASWRITELATENCY 16 \
  CONFIG.MC_CH0_DDR4_ACT_SKEW 0 \
  CONFIG.MC_CH0_DDR4_ADDR_SKEW_0 0 \
  CONFIG.MC_CH0_DDR4_ADDR_SKEW_1 0 \
  CONFIG.MC_CH0_DDR4_ADDR_SKEW_2 0 \
  CONFIG.MC_CH0_DDR4_ADDR_SKEW_3 0 \
  CONFIG.MC_CH0_DDR4_ADDR_SKEW_4 0 \
  CONFIG.MC_CH0_DDR4_ADDR_SKEW_5 0 \
  CONFIG.MC_CH0_DDR4_ADDR_SKEW_6 0 \
  CONFIG.MC_CH0_DDR4_ADDR_SKEW_7 0 \
  CONFIG.MC_CH0_DDR4_ADDR_SKEW_8 0 \
  CONFIG.MC_CH0_DDR4_ADDR_SKEW_9 0 \
  CONFIG.MC_CH0_DDR4_ADDR_SKEW_10 0 \
  CONFIG.MC_CH0_DDR4_ADDR_SKEW_11 0 \
  CONFIG.MC_CH0_DDR4_ADDR_SKEW_12 0 \
  CONFIG.MC_CH0_DDR4_ADDR_SKEW_13 0 \
  CONFIG.MC_CH0_DDR4_ADDR_SKEW_14 0 \
  CONFIG.MC_CH0_DDR4_ADDR_SKEW_15 0 \
  CONFIG.MC_CH0_DDR4_ADDR_SKEW_16 0 \
  CONFIG.MC_CH0_DDR4_ADDR_SKEW_17 0 \
  CONFIG.MC_CH0_DDR4_BA_SKEW_0 0 \
  CONFIG.MC_CH0_DDR4_BA_SKEW_1 0 \
  CONFIG.MC_CH0_DDR4_BG_SKEW_0 0 \
  CONFIG.MC_CH0_DDR4_BG_SKEW_1 0 \
  CONFIG.MC_CH0_DDR4_CKE_SKEW_0 0 \
  CONFIG.MC_CH0_DDR4_CKE_SKEW_1 0 \
  CONFIG.MC_CH0_DDR4_CKE_SKEW_2 0 \
  CONFIG.MC_CH0_DDR4_CKE_SKEW_3 0 \
  CONFIG.MC_CH0_DDR4_CK_SKEW_0 0 \
  CONFIG.MC_CH0_DDR4_CK_SKEW_1 0 \
  CONFIG.MC_CH0_DDR4_CK_SKEW_2 0 \
  CONFIG.MC_CH0_DDR4_CK_SKEW_3 0 \
  CONFIG.MC_CH0_DDR4_CS_SKEW_0 0 \
  CONFIG.MC_CH0_DDR4_CS_SKEW_1 0 \
  CONFIG.MC_CH0_DDR4_CS_SKEW_2 0 \
  CONFIG.MC_CH0_DDR4_CS_SKEW_3 0 \
  CONFIG.MC_CH0_DDR4_LR_SKEW_0 0 \
  CONFIG.MC_CH0_DDR4_LR_SKEW_1 0 \
  CONFIG.MC_CH0_DDR4_LR_SKEW_2 0 \
  CONFIG.MC_CH0_DDR4_ODT_SKEW_0 0 \
  CONFIG.MC_CH0_DDR4_ODT_SKEW_1 0 \
  CONFIG.MC_CH0_DDR4_ODT_SKEW_2 0 \
  CONFIG.MC_CH0_DDR4_ODT_SKEW_3 0 \
  CONFIG.MC_CH0_DDR4_PAR_SKEW 0 \
  CONFIG.MC_CH0_LP4_CHA_ENABLE false \
  CONFIG.MC_CH0_LP4_CHB_ENABLE false \
  CONFIG.MC_CH0_LP4_CKE_A_SKEW_0 0 \
  CONFIG.MC_CH0_LP4_CKE_A_SKEW_1 0 \
  CONFIG.MC_CH0_LP4_CKE_A_SKEW_2 0 \
  CONFIG.MC_CH0_LP4_CKE_A_SKEW_3 0 \
  CONFIG.MC_CH0_LP4_CKE_B_SKEW_0 0 \
  CONFIG.MC_CH0_LP4_CKE_B_SKEW_1 0 \
  CONFIG.MC_CH0_LP4_CKE_B_SKEW_2 0 \
  CONFIG.MC_CH0_LP4_CKE_B_SKEW_3 0 \
  CONFIG.MC_CH0_LP4_CK_A_SKEW_0 0 \
  CONFIG.MC_CH0_LP4_CK_A_SKEW_1 0 \
  CONFIG.MC_CH0_LP4_CK_A_SKEW_2 0 \
  CONFIG.MC_CH0_LP4_CK_A_SKEW_3 0 \
  CONFIG.MC_CH0_LP4_CK_B_SKEW_0 0 \
  CONFIG.MC_CH0_LP4_CK_B_SKEW_1 0 \
  CONFIG.MC_CH0_LP4_CK_B_SKEW_2 0 \
  CONFIG.MC_CH0_LP4_CK_B_SKEW_3 0 \
  CONFIG.MC_CH0_LP4_CS_A_SKEW_0 0 \
  CONFIG.MC_CH0_LP4_CS_A_SKEW_1 0 \
  CONFIG.MC_CH0_LP4_CS_A_SKEW_2 0 \
  CONFIG.MC_CH0_LP4_CS_A_SKEW_3 0 \
  CONFIG.MC_CH0_LP4_CS_B_SKEW_0 0 \
  CONFIG.MC_CH0_LP4_CS_B_SKEW_1 0 \
  CONFIG.MC_CH0_LP4_CS_B_SKEW_2 0 \
  CONFIG.MC_CH0_LP4_CS_B_SKEW_3 0 \
  CONFIG.MC_CH1_DDR4_ACT_SKEW 0 \
  CONFIG.MC_CH1_DDR4_ADDR_SKEW_0 0 \
  CONFIG.MC_CH1_DDR4_ADDR_SKEW_1 0 \
  CONFIG.MC_CH1_DDR4_ADDR_SKEW_2 0 \
  CONFIG.MC_CH1_DDR4_ADDR_SKEW_3 0 \
  CONFIG.MC_CH1_DDR4_ADDR_SKEW_4 0 \
  CONFIG.MC_CH1_DDR4_ADDR_SKEW_5 0 \
  CONFIG.MC_CH1_DDR4_ADDR_SKEW_6 0 \
  CONFIG.MC_CH1_DDR4_ADDR_SKEW_7 0 \
  CONFIG.MC_CH1_DDR4_ADDR_SKEW_8 0 \
  CONFIG.MC_CH1_DDR4_ADDR_SKEW_9 0 \
  CONFIG.MC_CH1_DDR4_ADDR_SKEW_10 0 \
  CONFIG.MC_CH1_DDR4_ADDR_SKEW_11 0 \
  CONFIG.MC_CH1_DDR4_ADDR_SKEW_12 0 \
  CONFIG.MC_CH1_DDR4_ADDR_SKEW_13 0 \
  CONFIG.MC_CH1_DDR4_ADDR_SKEW_14 0 \
  CONFIG.MC_CH1_DDR4_ADDR_SKEW_15 0 \
  CONFIG.MC_CH1_DDR4_ADDR_SKEW_16 0 \
  CONFIG.MC_CH1_DDR4_ADDR_SKEW_17 0 \
  CONFIG.MC_CH1_DDR4_BA_SKEW_0 0 \
  CONFIG.MC_CH1_DDR4_BA_SKEW_1 0 \
  CONFIG.MC_CH1_DDR4_BG_SKEW_0 0 \
  CONFIG.MC_CH1_DDR4_BG_SKEW_1 0 \
  CONFIG.MC_CH1_DDR4_CKE_SKEW_0 0 \
  CONFIG.MC_CH1_DDR4_CKE_SKEW_1 0 \
  CONFIG.MC_CH1_DDR4_CKE_SKEW_2 0 \
  CONFIG.MC_CH1_DDR4_CKE_SKEW_3 0 \
  CONFIG.MC_CH1_DDR4_CK_SKEW_0 0 \
  CONFIG.MC_CH1_DDR4_CK_SKEW_1 0 \
  CONFIG.MC_CH1_DDR4_CK_SKEW_2 0 \
  CONFIG.MC_CH1_DDR4_CK_SKEW_3 0 \
  CONFIG.MC_CH1_DDR4_CS_SKEW_0 0 \
  CONFIG.MC_CH1_DDR4_CS_SKEW_1 0 \
  CONFIG.MC_CH1_DDR4_CS_SKEW_2 0 \
  CONFIG.MC_CH1_DDR4_CS_SKEW_3 0 \
  CONFIG.MC_CH1_DDR4_LR_SKEW_0 0 \
  CONFIG.MC_CH1_DDR4_LR_SKEW_1 0 \
  CONFIG.MC_CH1_DDR4_LR_SKEW_2 0 \
  CONFIG.MC_CH1_DDR4_ODT_SKEW_0 0 \
  CONFIG.MC_CH1_DDR4_ODT_SKEW_1 0 \
  CONFIG.MC_CH1_DDR4_ODT_SKEW_2 0 \
  CONFIG.MC_CH1_DDR4_ODT_SKEW_3 0 \
  CONFIG.MC_CH1_DDR4_PAR_SKEW 0 \
  CONFIG.MC_CH1_LP4_CHA_ENABLE false \
  CONFIG.MC_CH1_LP4_CHB_ENABLE false \
  CONFIG.MC_CH1_LP4_CKE_A_SKEW_0 0 \
  CONFIG.MC_CH1_LP4_CKE_A_SKEW_1 0 \
  CONFIG.MC_CH1_LP4_CKE_A_SKEW_2 0 \
  CONFIG.MC_CH1_LP4_CKE_A_SKEW_3 0 \
  CONFIG.MC_CH1_LP4_CKE_B_SKEW_0 0 \
  CONFIG.MC_CH1_LP4_CKE_B_SKEW_1 0 \
  CONFIG.MC_CH1_LP4_CKE_B_SKEW_2 0 \
  CONFIG.MC_CH1_LP4_CKE_B_SKEW_3 0 \
  CONFIG.MC_CH1_LP4_CK_A_SKEW_0 0 \
  CONFIG.MC_CH1_LP4_CK_A_SKEW_1 0 \
  CONFIG.MC_CH1_LP4_CK_A_SKEW_2 0 \
  CONFIG.MC_CH1_LP4_CK_A_SKEW_3 0 \
  CONFIG.MC_CH1_LP4_CK_B_SKEW_0 0 \
  CONFIG.MC_CH1_LP4_CK_B_SKEW_1 0 \
  CONFIG.MC_CH1_LP4_CK_B_SKEW_2 0 \
  CONFIG.MC_CH1_LP4_CK_B_SKEW_3 0 \
  CONFIG.MC_CH1_LP4_CS_A_SKEW_0 0 \
  CONFIG.MC_CH1_LP4_CS_A_SKEW_1 0 \
  CONFIG.MC_CH1_LP4_CS_A_SKEW_2 0 \
  CONFIG.MC_CH1_LP4_CS_A_SKEW_3 0 \
  CONFIG.MC_CH1_LP4_CS_B_SKEW_0 0 \
  CONFIG.MC_CH1_LP4_CS_B_SKEW_1 0 \
  CONFIG.MC_CH1_LP4_CS_B_SKEW_2 0 \
  CONFIG.MC_CH1_LP4_CS_B_SKEW_3 0 \
  CONFIG.MC_CHAN_REGION0 DDR_LOW0 \
  CONFIG.MC_CHAN_REGION1 DDR_LOW1 \
  CONFIG.MC_CKE_WIDTH 1 \
  CONFIG.MC_CK_WIDTH 1 \
  CONFIG.MC_CLA 0 \
  CONFIG.MC_COLUMNADDRESSWIDTH 10 \
  CONFIG.MC_COMPONENT_WIDTH x8 \
  CONFIG.MC_CONFIG_NUM config17 \
  CONFIG.MC_CORRECT_EN 1 \
  CONFIG.MC_CS_WIDTH 1 \
  CONFIG.MC_DATAWIDTH 64 \
  CONFIG.MC_DC_CMD_CREDITS 0x000002a8 \
  CONFIG.MC_DDR4_2T Disable \
  CONFIG.MC_DDR4_MIGRATION false \
  CONFIG.MC_DISABLE_DATA_CHECK 1 \
  CONFIG.MC_DM_WIDTH 8 \
  CONFIG.MC_DQS_WIDTH 8 \
  CONFIG.MC_DQ_WIDTH 64 \
  CONFIG.MC_ECC_SCRUB_SIZE 8192 \
  CONFIG.MC_EN_INTR_RESP FALSE \
  CONFIG.MC_EN_NPP_MONITOR 1 \
  CONFIG.MC_EN_PERF_STATS false \
  CONFIG.MC_EXMON_CLR_EXE 0x00000100 \
  CONFIG.MC_EXTENDED_WDQS TRUE \
  CONFIG.MC_F1_ADD_CMD_DELAY 0 \
  CONFIG.MC_F1_ADD_CMD_DELAY_EN Disable \
  CONFIG.MC_F1_CASLATENCY 24 \
  CONFIG.MC_F1_CASWRITELATENCY 20 \
  CONFIG.MC_F1_CLA 0 \
  CONFIG.MC_F1_LPDDR4_MR1 0x0000 \
  CONFIG.MC_F1_LPDDR4_MR2 0x0000 \
  CONFIG.MC_F1_LPDDR4_MR3 0x0000 \
  CONFIG.MC_F1_LPDDR4_MR11 0x0000 \
  CONFIG.MC_F1_LPDDR4_MR13 0x0000 \
  CONFIG.MC_F1_LPDDR4_MR22 0x0000 \
  CONFIG.MC_F1_ODTLon 0 \
  CONFIG.MC_F1_PARITYLATENCY 0 \
  CONFIG.MC_F1_RCD_DELAY 0 \
  CONFIG.MC_F1_TCCD_3DS 0 \
  CONFIG.MC_F1_TCCD_3DS_MIN 0 \
  CONFIG.MC_F1_TCCD_L 8 \
  CONFIG.MC_F1_TCCD_L_MIN 8 \
  CONFIG.MC_F1_TCKE 0 \
  CONFIG.MC_F1_TCKEMIN 0 \
  CONFIG.MC_F1_TFAW 21000 \
  CONFIG.MC_F1_TFAWMIN 21000 \
  CONFIG.MC_F1_TMOD 24 \
  CONFIG.MC_F1_TMOD_MIN 24 \
  CONFIG.MC_F1_TMRD 8 \
  CONFIG.MC_F1_TMRDMIN 8 \
  CONFIG.MC_F1_TMRD_nCK 0 \
  CONFIG.MC_F1_TMRW 0 \
  CONFIG.MC_F1_TMRWMIN 0 \
  CONFIG.MC_F1_TODTon_MIN 0 \
  CONFIG.MC_F1_TOSCO 0 \
  CONFIG.MC_F1_TOSCOMIN 0 \
  CONFIG.MC_F1_TOSCO_nCK 0 \
  CONFIG.MC_F1_TPDM_RD 0 \
  CONFIG.MC_F1_TRAS 32000 \
  CONFIG.MC_F1_TRASMIN 32000 \
  CONFIG.MC_F1_TRAS_nCK 0 \
  CONFIG.MC_F1_TRCD 13750 \
  CONFIG.MC_F1_TRCDMIN 13750 \
  CONFIG.MC_F1_TRCD_nCK 0 \
  CONFIG.MC_F1_TRPAB 0 \
  CONFIG.MC_F1_TRPABMIN 0 \
  CONFIG.MC_F1_TRPAB_nCK 0 \
  CONFIG.MC_F1_TRPPB 0 \
  CONFIG.MC_F1_TRPPBMIN 0 \
  CONFIG.MC_F1_TRPPB_nCK 0 \
  CONFIG.MC_F1_TRRD 0 \
  CONFIG.MC_F1_TRRDMIN 0 \
  CONFIG.MC_F1_TRRD_L 8 \
  CONFIG.MC_F1_TRRD_L_MIN 8 \
  CONFIG.MC_F1_TRRD_S 4 \
  CONFIG.MC_F1_TRRD_S_MIN 4 \
  CONFIG.MC_F1_TRTP 7500 \
  CONFIG.MC_F1_TRTPMIN 7500 \
  CONFIG.MC_F1_TWR 15000 \
  CONFIG.MC_F1_TWRMIN 15000 \
  CONFIG.MC_F1_TWR_nCK 0 \
  CONFIG.MC_F1_TWTR 0 \
  CONFIG.MC_F1_TWTRMIN 0 \
  CONFIG.MC_F1_TWTR_L 7500 \
  CONFIG.MC_F1_TWTR_L_MIN 7500 \
  CONFIG.MC_F1_TWTR_S 2500 \
  CONFIG.MC_F1_TWTR_S_MIN 2500 \
  CONFIG.MC_F1_TWTR_nCK 0 \
  CONFIG.MC_F1_TXP 0 \
  CONFIG.MC_F1_TXPMIN 0 \
  CONFIG.MC_F1_TZQLAT 0 \
  CONFIG.MC_F1_TZQLATMIN 0 \
  CONFIG.MC_F1_TZQLAT_nCK 0 \
  CONFIG.MC_FCV_FULLCAL Disable \
  CONFIG.MC_FLIPPED_PINOUT false \
  CONFIG.MC_FREQ_PARAM F0 \
  CONFIG.MC_FREQ_SEL SYS_CLK_FROM_MEMORY_CLK \
  CONFIG.MC_FREQ_SWITCHING_EN FALSE \
  CONFIG.MC_IBUFDISABLE false \
  CONFIG.MC_IDLE_TIME_ENTR_PWR_DOWN_MODE 0x00000AA \
  CONFIG.MC_IDLE_TIME_ENTR_SELF_REF_MODE 0x0020000 \
  CONFIG.MC_INPUTCLK0_PERIOD 5000 \
  CONFIG.MC_INPUTCLK1_PERIOD 2500 \
  CONFIG.MC_INPUT_FREQUENCY1 400.000 \
  CONFIG.MC_INTERLEAVE_SIZE 128 \
  CONFIG.MC_INTERNAL_CA_PARITY_EN FALSE \
  CONFIG.MC_INTERNAL_SYSCLK_EN false \
  CONFIG.MC_IP_TIMEPERIOD1 625 \
  CONFIG.MC_ISOC_READ_TIMEOUT 3 \
  CONFIG.MC_ISOC_WRITE_TIMEOUT 3 \
  CONFIG.MC_LP4_CA_A_WIDTH 0 \
  CONFIG.MC_LP4_CA_B_WIDTH 0 \
  CONFIG.MC_LP4_CKE_A_WIDTH 0 \
  CONFIG.MC_LP4_CKE_B_WIDTH 0 \
  CONFIG.MC_LP4_CKT_A_WIDTH 0 \
  CONFIG.MC_LP4_CKT_B_WIDTH 0 \
  CONFIG.MC_LP4_CS_A_WIDTH 0 \
  CONFIG.MC_LP4_CS_B_WIDTH 0 \
  CONFIG.MC_LP4_DMI_A_WIDTH 0 \
  CONFIG.MC_LP4_DMI_B_WIDTH 0 \
  CONFIG.MC_LP4_DQS_A_WIDTH 0 \
  CONFIG.MC_LP4_DQS_B_WIDTH 0 \
  CONFIG.MC_LP4_DQ_A_WIDTH 0 \
  CONFIG.MC_LP4_DQ_B_WIDTH 0 \
  CONFIG.MC_LP4_OPERATING_TEMP STANDARD \
  CONFIG.MC_LP4_OVERWRITE_IO_PROP false \
  CONFIG.MC_LP4_RESETN_WIDTH 0 \
  CONFIG.MC_LPDDR4_REFRESH_TYPE ALL_BANK \
  CONFIG.MC_LR_WIDTH 1 \
  CONFIG.MC_MAIN_BASE_ADDR 0xF6150000 \
  CONFIG.MC_MAIN_MODULE_NAME DDRMC_MAIN_0 \
  CONFIG.MC_MEMORY_DEVICETYPE UDIMMs \
  CONFIG.MC_MEMORY_FREQUENCY1 625 \
  CONFIG.MC_MEMORY_FREQUENCY2 625 \
  CONFIG.MC_MEMORY_SPEEDGRADE {DDR4-3200AA(22-22-22)} \
  CONFIG.MC_MEMORY_TIMEPERIOD0 625 \
  CONFIG.MC_MEM_ADDRESS_MAP ROW_COLUMN_BANK \
  CONFIG.MC_MEM_INIT_FILE no_file_loaded \
  CONFIG.MC_MIN_VLD_CNT_CTRL false \
  CONFIG.MC_NETLIST_SIMULATION false \
  CONFIG.MC_NOC_BASE_ADDR 0xF6070000 \
  CONFIG.MC_NOC_MODULE_NAME DDRMC_NOC_0 \
  CONFIG.MC_NO_CHANNELS Single \
  CONFIG.MC_ODTLon 0 \
  CONFIG.MC_ODT_WIDTH 1 \
  CONFIG.MC_ORDERING Strict \
  CONFIG.MC_PARITY false \
  CONFIG.MC_PARITYLATENCY 0 \
  CONFIG.MC_PER_RD_INTVL 20000000 \
  CONFIG.MC_PHYS_NAME DDRMC_X1Y0 \
  CONFIG.MC_POWERMODES true \
  CONFIG.MC_PRE_DEF_ADDR_MAP_SEL ROW_COLUMN_BANK \
  CONFIG.MC_PRUNECHIP_SIM_CHANGES Disable \
  CONFIG.MC_RANK 1 \
  CONFIG.MC_RCD_DELAY 0 \
  CONFIG.MC_RCD_PARITY false \
  CONFIG.MC_READ_BANDWIDTH 6400.000 \
  CONFIG.MC_READ_DBI false \
  CONFIG.MC_REFRESH_RATE 1x \
  CONFIG.MC_REF_AND_PER_CAL_INTF FALSE \
  CONFIG.MC_REGION 0 \
  CONFIG.MC_REGVAL_COMPARE false \
  CONFIG.MC_REG_ADEC0 0x00000000 \
  CONFIG.MC_REG_ADEC1 0x00000000 \
  CONFIG.MC_REG_ADEC2 0x00100080 \
  CONFIG.MC_REG_ADEC3 0x00000078 \
  CONFIG.MC_REG_ADEC4 0x30c30c30 \
  CONFIG.MC_REG_ADEC5 0x15513491 \
  CONFIG.MC_REG_ADEC6 0x1a6585d6 \
  CONFIG.MC_REG_ADEC7 0x1f79d71b \
  CONFIG.MC_REG_ADEC8 0x03c30c20 \
  CONFIG.MC_REG_ADEC9 0x0c2ca144 \
  CONFIG.MC_REG_ADEC10 0x0840f38d \
  CONFIG.MC_REG_ADEC11 0x00c07189 \
  CONFIG.MC_REG_CMDQ_BER_RATE_CTRL 0x003ffc0f \
  CONFIG.MC_REG_CMDQ_BEW_RATE_CTRL 0x003ffc0f \
  CONFIG.MC_REG_CMDQ_CTRL0 0x01ffffff \
  CONFIG.MC_REG_CMDQ_CTRL1 0x01084210 \
  CONFIG.MC_REG_CMDQ_ISR_RATE_CTRL 0x003ffc0f \
  CONFIG.MC_REG_CMDQ_ISW_RATE_CTRL 0x003ffc0f \
  CONFIG.MC_REG_CMDQ_LLR_RATE_CTRL 0x003ffc0f \
  CONFIG.MC_REG_NSU0_PORT 0x00000400 \
  CONFIG.MC_REG_NSU1_PORT 0x00000440 \
  CONFIG.MC_REG_NSU2_PORT 0x00000480 \
  CONFIG.MC_REG_NSU3_PORT 0x000004c0 \
  CONFIG.MC_REG_P0_BER_RATE_CTRL 0x003ffc0f \
  CONFIG.MC_REG_P0_BEW_RATE_CTRL 0x003ffc0f \
  CONFIG.MC_REG_P0_ISR_RATE_CTRL 0x003ffc0f \
  CONFIG.MC_REG_P0_ISW_RATE_CTRL 0x003ffc0f \
  CONFIG.MC_REG_P0_LLR_RATE_CTRL 0x003ffc0f \
  CONFIG.MC_REG_P1_BER_RATE_CTRL 0x003ffc0f \
  CONFIG.MC_REG_P1_BEW_RATE_CTRL 0x003ffc0f \
  CONFIG.MC_REG_P1_ISR_RATE_CTRL 0x003ffc0f \
  CONFIG.MC_REG_P1_ISW_RATE_CTRL 0x003ffc0f \
  CONFIG.MC_REG_P1_LLR_RATE_CTRL 0x003ffc0f \
  CONFIG.MC_REG_P2_BER_RATE_CTRL 0x003ffc0f \
  CONFIG.MC_REG_P2_BEW_RATE_CTRL 0x003ffc0f \
  CONFIG.MC_REG_P2_ISR_RATE_CTRL 0x003ffc0f \
  CONFIG.MC_REG_P2_ISW_RATE_CTRL 0x003ffc0f \
  CONFIG.MC_REG_P2_LLR_RATE_CTRL 0x003ffc0f \
  CONFIG.MC_REG_P3_BER_RATE_CTRL 0x003ffc0f \
  CONFIG.MC_REG_P3_BEW_RATE_CTRL 0x003ffc0f \
  CONFIG.MC_REG_P3_ISR_RATE_CTRL 0x003ffc0f \
  CONFIG.MC_REG_P3_ISW_RATE_CTRL 0x003ffc0f \
  CONFIG.MC_REG_P3_LLR_RATE_CTRL 0x003ffc0f \
  CONFIG.MC_REG_QOS0 0x001e01e0 \
  CONFIG.MC_REG_QOS1 0x0ff00804 \
  CONFIG.MC_REG_QOS2 0x0003fc02 \
  CONFIG.MC_REG_QOS_RATE_CTRL_SCALE 0x00000000 \
  CONFIG.MC_REG_QOS_TIMEOUT0 0x00421084 \
  CONFIG.MC_REG_QOS_TIMEOUT1 0xbbbbbbbb \
  CONFIG.MC_REG_QOS_TIMEOUT2 0x000000bb \
  CONFIG.MC_REG_RATE_CTRL_SCALE 0x00000000 \
  CONFIG.MC_REG_RD_DRR_TKN_P0 0x001d0404 \
  CONFIG.MC_REG_RD_DRR_TKN_P1 0x00ff0404 \
  CONFIG.MC_REG_RD_DRR_TKN_P2 0x00ff0404 \
  CONFIG.MC_REG_RD_DRR_TKN_P3 0x00ff0404 \
  CONFIG.MC_REG_WR_DRR_TKN_P0 0x00001d04 \
  CONFIG.MC_REG_WR_DRR_TKN_P1 0x0000ff04 \
  CONFIG.MC_REG_WR_DRR_TKN_P2 0x0000ff04 \
  CONFIG.MC_REG_WR_DRR_TKN_P3 0x0000ff04 \
  CONFIG.MC_ROWADDRESSWIDTH 16 \
  CONFIG.MC_RTT RZQ/6 \
  CONFIG.MC_SAVERESTORE false \
  CONFIG.MC_SCRUBBING off \
  CONFIG.MC_SELFREFRESH false \
  CONFIG.MC_SIMMODE BFM \
  CONFIG.MC_SKIPCAL Disable \
  CONFIG.MC_SLOT Single \
  CONFIG.MC_STACKHEIGHT 1 \
  CONFIG.MC_SVFLOW Disable \
  CONFIG.MC_SYSTEM_CLOCK Differential \
  CONFIG.MC_TCCD 0 \
  CONFIG.MC_TCCDMW 32 \
  CONFIG.MC_TCCD_3DS 0 \
  CONFIG.MC_TCCD_3DS_MIN 0 \
  CONFIG.MC_TCCD_L 8 \
  CONFIG.MC_TCCD_L_MIN 8 \
  CONFIG.MC_TCCD_S 4 \
  CONFIG.MC_TCK 628 \
  CONFIG.MC_TCKE 8 \
  CONFIG.MC_TCKEMIN 8 \
  CONFIG.MC_TCMR_MRD 0 \
  CONFIG.MC_TDQS2DQ_MAX 0 \
  CONFIG.MC_TDQS2DQ_MIN 0 \
  CONFIG.MC_TDQSCK_MAX 0 \
  CONFIG.MC_TDQSCK_MIN 1500 \
  CONFIG.MC_TDQSS_MAX 1.25 \
  CONFIG.MC_TDQSS_MIN 0.75 \
  CONFIG.MC_TEMP_DIR_DELETE TRUE \
  CONFIG.MC_TFAW 21000 \
  CONFIG.MC_TFAWMIN 21000 \
  CONFIG.MC_TFAW_DLR 0 \
  CONFIG.MC_TMOD 24 \
  CONFIG.MC_TMOD_MIN 24 \
  CONFIG.MC_TMRD 8 \
  CONFIG.MC_TMRDMIN 8 \
  CONFIG.MC_TMRD_div4 0 \
  CONFIG.MC_TMRD_nCK 0 \
  CONFIG.MC_TMRR 8 \
  CONFIG.MC_TMRW 0 \
  CONFIG.MC_TMRWMIN 0 \
  CONFIG.MC_TMRW_div4 0 \
  CONFIG.MC_TMRW_nCK 0 \
  CONFIG.MC_TODTon_MIN 0 \
  CONFIG.MC_TOSCO 0 \
  CONFIG.MC_TOSCOMIN 0 \
  CONFIG.MC_TOSCO_nCK 0 \
  CONFIG.MC_TPBR2PBR 0 \
  CONFIG.MC_TPBR2PBRMIN 0 \
  CONFIG.MC_TPDM_RD 0 \
  CONFIG.MC_TRAS 32000 \
  CONFIG.MC_TRASMIN 32000 \
  CONFIG.MC_TRAS_nCK 0 \
  CONFIG.MC_TRC 45750 \
  CONFIG.MC_TRCD 13750 \
  CONFIG.MC_TRCDMIN 13750 \
  CONFIG.MC_TRCD_nCK 0 \
  CONFIG.MC_TRCMIN 45750 \
  CONFIG.MC_TREFI 7800000 \
  CONFIG.MC_TREFIPB 0 \
  CONFIG.MC_TRFC 350000 \
  CONFIG.MC_TRFCAB 0 \
  CONFIG.MC_TRFCABMIN 0 \
  CONFIG.MC_TRFCMIN 350000 \
  CONFIG.MC_TRFCPB 0 \
  CONFIG.MC_TRFCPBMIN 0 \
  CONFIG.MC_TRFC_DLR 0 \
  CONFIG.MC_TRP 13750 \
  CONFIG.MC_TRPAB 0 \
  CONFIG.MC_TRPABMIN 0 \
  CONFIG.MC_TRPAB_nCK 0 \
  CONFIG.MC_TRPMIN 13750 \
  CONFIG.MC_TRPPB 0 \
  CONFIG.MC_TRPPBMIN 0 \
  CONFIG.MC_TRPPB_nCK 0 \
  CONFIG.MC_TRPRE 0.9 \
  CONFIG.MC_TRPST 0.4 \
  CONFIG.MC_TRRD 0 \
  CONFIG.MC_TRRDMIN 0 \
  CONFIG.MC_TRRD_DLR 0 \
  CONFIG.MC_TRRD_L 8 \
  CONFIG.MC_TRRD_L_MIN 8 \
  CONFIG.MC_TRRD_S 4 \
  CONFIG.MC_TRRD_S_MIN 4 \
  CONFIG.MC_TRRD_nCK 0 \
  CONFIG.MC_TRTP 7500 \
  CONFIG.MC_TRTPMIN 7500 \
  CONFIG.MC_TRTW 350 \
  CONFIG.MC_TSTAB 0 \
  CONFIG.MC_TWPRE 0.9 \
  CONFIG.MC_TWPST 0.33 \
  CONFIG.MC_TWR 15000 \
  CONFIG.MC_TWRMIN 15000 \
  CONFIG.MC_TWR_nCK 0 \
  CONFIG.MC_TWTR 0 \
  CONFIG.MC_TWTRMIN 0 \
  CONFIG.MC_TWTR_L 7500 \
  CONFIG.MC_TWTR_L_MIN 0 \
  CONFIG.MC_TWTR_S 2500 \
  CONFIG.MC_TWTR_S_MIN 2500 \
  CONFIG.MC_TWTR_nCK 0 \
  CONFIG.MC_TXP 10 \
  CONFIG.MC_TXPMIN 10 \
  CONFIG.MC_TXPR 576 \
  CONFIG.MC_TZQCAL 0 \
  CONFIG.MC_TZQCAL_div4 0 \
  CONFIG.MC_TZQCS 128 \
  CONFIG.MC_TZQCS_ITVL 1000000000 \
  CONFIG.MC_TZQINIT 1024 \
  CONFIG.MC_TZQLAT 0 \
  CONFIG.MC_TZQLATMIN 0 \
  CONFIG.MC_TZQLAT_div4 0 \
  CONFIG.MC_TZQLAT_nCK 0 \
  CONFIG.MC_TZQ_START_ITVL 0 \
  CONFIG.MC_UBLAZE_APB_INTF FALSE \
  CONFIG.MC_UB_CLK_MUX 0x00000000 \
  CONFIG.MC_USERREFRESH false \
  CONFIG.MC_USER_DEFINED_ADDRESS_MAP 16RA-2BA-2BG-10CA \
  CONFIG.MC_VNC_ENABLE FALSE \
  CONFIG.MC_WRITE_BANDWIDTH 6400.000 \
  CONFIG.MC_WRITE_DM_DBI DM_NO_DBI \
  CONFIG.MC_XLNX_RESPONDER true \
  CONFIG.MC_XMPU_CONFIG0 0x00000008 \
  CONFIG.MC_XMPU_CONFIG1 0x00000008 \
  CONFIG.MC_XMPU_CONFIG2 0x00000008 \
  CONFIG.MC_XMPU_CONFIG3 0x00000008 \
  CONFIG.MC_XMPU_CONFIG4 0x00000008 \
  CONFIG.MC_XMPU_CONFIG5 0x00000008 \
  CONFIG.MC_XMPU_CONFIG6 0x00000008 \
  CONFIG.MC_XMPU_CONFIG7 0x00000008 \
  CONFIG.MC_XMPU_CONFIG8 0x00000008 \
  CONFIG.MC_XMPU_CONFIG9 0x00000008 \
  CONFIG.MC_XMPU_CONFIG10 0x00000008 \
  CONFIG.MC_XMPU_CONFIG11 0x00000008 \
  CONFIG.MC_XMPU_CONFIG12 0x00000008 \
  CONFIG.MC_XMPU_CONFIG13 0x00000008 \
  CONFIG.MC_XMPU_CONFIG14 0x00000008 \
  CONFIG.MC_XMPU_CONFIG15 0x00000008 \
  CONFIG.MC_XMPU_CTRL 0x0000000b \
  CONFIG.MC_XMPU_END_HI0 0x00000000 \
  CONFIG.MC_XMPU_END_HI1 0x00000000 \
  CONFIG.MC_XMPU_END_HI2 0x00000000 \
  CONFIG.MC_XMPU_END_HI3 0x00000000 \
  CONFIG.MC_XMPU_END_HI4 0x00000000 \
  CONFIG.MC_XMPU_END_HI5 0x00000000 \
  CONFIG.MC_XMPU_END_HI6 0x00000000 \
  CONFIG.MC_XMPU_END_HI7 0x00000000 \
  CONFIG.MC_XMPU_END_HI8 0x00000000 \
  CONFIG.MC_XMPU_END_HI9 0x00000000 \
  CONFIG.MC_XMPU_END_HI10 0x00000000 \
  CONFIG.MC_XMPU_END_HI11 0x00000000 \
  CONFIG.MC_XMPU_END_HI12 0x00000000 \
  CONFIG.MC_XMPU_END_HI13 0x00000000 \
  CONFIG.MC_XMPU_END_HI14 0x00000000 \
  CONFIG.MC_XMPU_END_HI15 0x00000000 \
  CONFIG.MC_XMPU_END_LO0 0x00000000 \
  CONFIG.MC_XMPU_END_LO1 0x00000000 \
  CONFIG.MC_XMPU_END_LO2 0x00000000 \
  CONFIG.MC_XMPU_END_LO3 0x00000000 \
  CONFIG.MC_XMPU_END_LO4 0x00000000 \
  CONFIG.MC_XMPU_END_LO5 0x00000000 \
  CONFIG.MC_XMPU_END_LO6 0x00000000 \
  CONFIG.MC_XMPU_END_LO7 0x00000000 \
  CONFIG.MC_XMPU_END_LO8 0x00000000 \
  CONFIG.MC_XMPU_END_LO9 0x00000000 \
  CONFIG.MC_XMPU_END_LO10 0x00000000 \
  CONFIG.MC_XMPU_END_LO11 0x00000000 \
  CONFIG.MC_XMPU_END_LO12 0x00000000 \
  CONFIG.MC_XMPU_END_LO13 0x00000000 \
  CONFIG.MC_XMPU_END_LO14 0x00000000 \
  CONFIG.MC_XMPU_END_LO15 0x00000000 \
  CONFIG.MC_XMPU_MASTER0 0x00000000 \
  CONFIG.MC_XMPU_MASTER1 0x00000000 \
  CONFIG.MC_XMPU_MASTER2 0x00000000 \
  CONFIG.MC_XMPU_MASTER3 0x00000000 \
  CONFIG.MC_XMPU_MASTER4 0x00000000 \
  CONFIG.MC_XMPU_MASTER5 0x00000000 \
  CONFIG.MC_XMPU_MASTER6 0x00000000 \
  CONFIG.MC_XMPU_MASTER7 0x00000000 \
  CONFIG.MC_XMPU_MASTER8 0x00000000 \
  CONFIG.MC_XMPU_MASTER9 0x00000000 \
  CONFIG.MC_XMPU_MASTER10 0x00000000 \
  CONFIG.MC_XMPU_MASTER11 0x00000000 \
  CONFIG.MC_XMPU_MASTER12 0x00000000 \
  CONFIG.MC_XMPU_MASTER13 0x00000000 \
  CONFIG.MC_XMPU_MASTER14 0x00000000 \
  CONFIG.MC_XMPU_MASTER15 0x00000000 \
  CONFIG.MC_XMPU_START_HI0 0x00000000 \
  CONFIG.MC_XMPU_START_HI1 0x00000000 \
  CONFIG.MC_XMPU_START_HI2 0x00000000 \
  CONFIG.MC_XMPU_START_HI3 0x00000000 \
  CONFIG.MC_XMPU_START_HI4 0x00000000 \
  CONFIG.MC_XMPU_START_HI5 0x00000000 \
  CONFIG.MC_XMPU_START_HI6 0x00000000 \
  CONFIG.MC_XMPU_START_HI7 0x00000000 \
  CONFIG.MC_XMPU_START_HI8 0x00000000 \
  CONFIG.MC_XMPU_START_HI9 0x00000000 \
  CONFIG.MC_XMPU_START_HI10 0x00000000 \
  CONFIG.MC_XMPU_START_HI11 0x00000000 \
  CONFIG.MC_XMPU_START_HI12 0x00000000 \
  CONFIG.MC_XMPU_START_HI13 0x00000000 \
  CONFIG.MC_XMPU_START_HI14 0x00000000 \
  CONFIG.MC_XMPU_START_HI15 0x00000000 \
  CONFIG.MC_XMPU_START_LO0 0x00000000 \
  CONFIG.MC_XMPU_START_LO1 0x00000000 \
  CONFIG.MC_XMPU_START_LO2 0x00000000 \
  CONFIG.MC_XMPU_START_LO3 0x00000000 \
  CONFIG.MC_XMPU_START_LO4 0x00000000 \
  CONFIG.MC_XMPU_START_LO5 0x00000000 \
  CONFIG.MC_XMPU_START_LO6 0x00000000 \
  CONFIG.MC_XMPU_START_LO7 0x00000000 \
  CONFIG.MC_XMPU_START_LO8 0x00000000 \
  CONFIG.MC_XMPU_START_LO9 0x00000000 \
  CONFIG.MC_XMPU_START_LO10 0x00000000 \
  CONFIG.MC_XMPU_START_LO11 0x00000000 \
  CONFIG.MC_XMPU_START_LO12 0x00000000 \
  CONFIG.MC_XMPU_START_LO13 0x00000000 \
  CONFIG.MC_XMPU_START_LO14 0x00000000 \
  CONFIG.MC_XMPU_START_LO15 0x00000000 \
  CONFIG.MC_XPLL_CLKOUT1_PERIOD 1250 \
  CONFIG.MC_XPLL_CLKOUT1_PH_CTRL 0x3 \
  CONFIG.MC_XPLL_CLKOUT2_PHASE 0.0 \
  CONFIG.MC_XPLL_CLKOUT2_PH_CTRL 0x1 \
  CONFIG.MC_XPLL_CLKOUTPHY_CASCIN_EN TRUE \
  CONFIG.MC_XPLL_CLKOUTPHY_CASCOUT_EN FALSE \
  CONFIG.MC_XPLL_DESKEW2_MUXIN_SEL TRUE \
  CONFIG.MC_XPLL_DESKEW_MUXIN_SEL TRUE \
  CONFIG.MC_XPLL_DIV4_CLKOUT3 TRUE \
  CONFIG.MC_XPLL_DIV4_CLKOUT12 TRUE \
  CONFIG.MC_XPLL_DSKW_DLY1 12 \
  CONFIG.MC_XPLL_DSKW_DLY2 15 \
  CONFIG.MC_XPLL_DSKW_DLY_EN1 TRUE \
  CONFIG.MC_XPLL_DSKW_DLY_EN2 TRUE \
  CONFIG.MC_XPLL_DSKW_DLY_PATH1 FALSE \
  CONFIG.MC_XPLL_DSKW_DLY_PATH2 TRUE \
  CONFIG.MC_XPLL_MODE VarRxVarTx \
  CONFIG.MC_ZQCS_FREQUENCY true \
  CONFIG.MC_ZQCS_PIN true \
  CONFIG.MC_ZQINTVL 350 \
  CONFIG.NOC_FREQ 1000 \
  CONFIG.NUM_MC 1 \
  CONFIG.USER_NPI_REG_MC_NSU_0_EGR 0x00473610 \
  CONFIG.USER_NPI_REG_MC_NSU_0_ING 0x04534101 \
  CONFIG.USER_NPI_REG_MC_NSU_0_R_EGR 0x01010100 \
  CONFIG.USER_NPI_REG_MC_NSU_0_W_EGR 0x00010100 \
  CONFIG.USER_NPI_REG_MC_NSU_1_EGR 0x00473610 \
  CONFIG.USER_NPI_REG_MC_NSU_1_ING 0x04534101 \
  CONFIG.USER_NPI_REG_MC_NSU_1_R_EGR 0x01010100 \
  CONFIG.USER_NPI_REG_MC_NSU_1_W_EGR 0x00010100 \
  CONFIG.USER_NPI_REG_MC_NSU_2_EGR 0x00473610 \
  CONFIG.USER_NPI_REG_MC_NSU_2_ING 0x04534101 \
  CONFIG.USER_NPI_REG_MC_NSU_2_R_EGR 0x01010100 \
  CONFIG.USER_NPI_REG_MC_NSU_2_W_EGR 0x00010100 \
  CONFIG.USER_NPI_REG_MC_NSU_3_EGR 0x00473610 \
  CONFIG.USER_NPI_REG_MC_NSU_3_ING 0x04534101 \
  CONFIG.USER_NPI_REG_MC_NSU_3_R_EGR 0x01010100 \
  CONFIG.USER_NPI_REG_MC_NSU_3_W_EGR 0x00010100 \
] [get_bd_cells MC0_ddrc]
